# Altium schematic sheet AEGIS_Junction_Box.SchDoc: AEGIS
size 420 x 297 mm; Author: G.Kasprowicz; CompanyName: WUT ISE; DrawnBy: G.Kasprowicz; Organization: WUT ISE; Address1: PW ISE; Address2: Nowowiejska 15/19 00-665 Warsaw; Address3: gkasprow@gmail.com; Revision: 2; SheetNumber: -; SheetTotal: -; ModifiedBy: -; CheckedDate: -; Title2: Junction Box; DivGrp: WUT ISE; Designer: G.Kasprowicz; ModifiedDate: -; ProjectName: Sensor Box
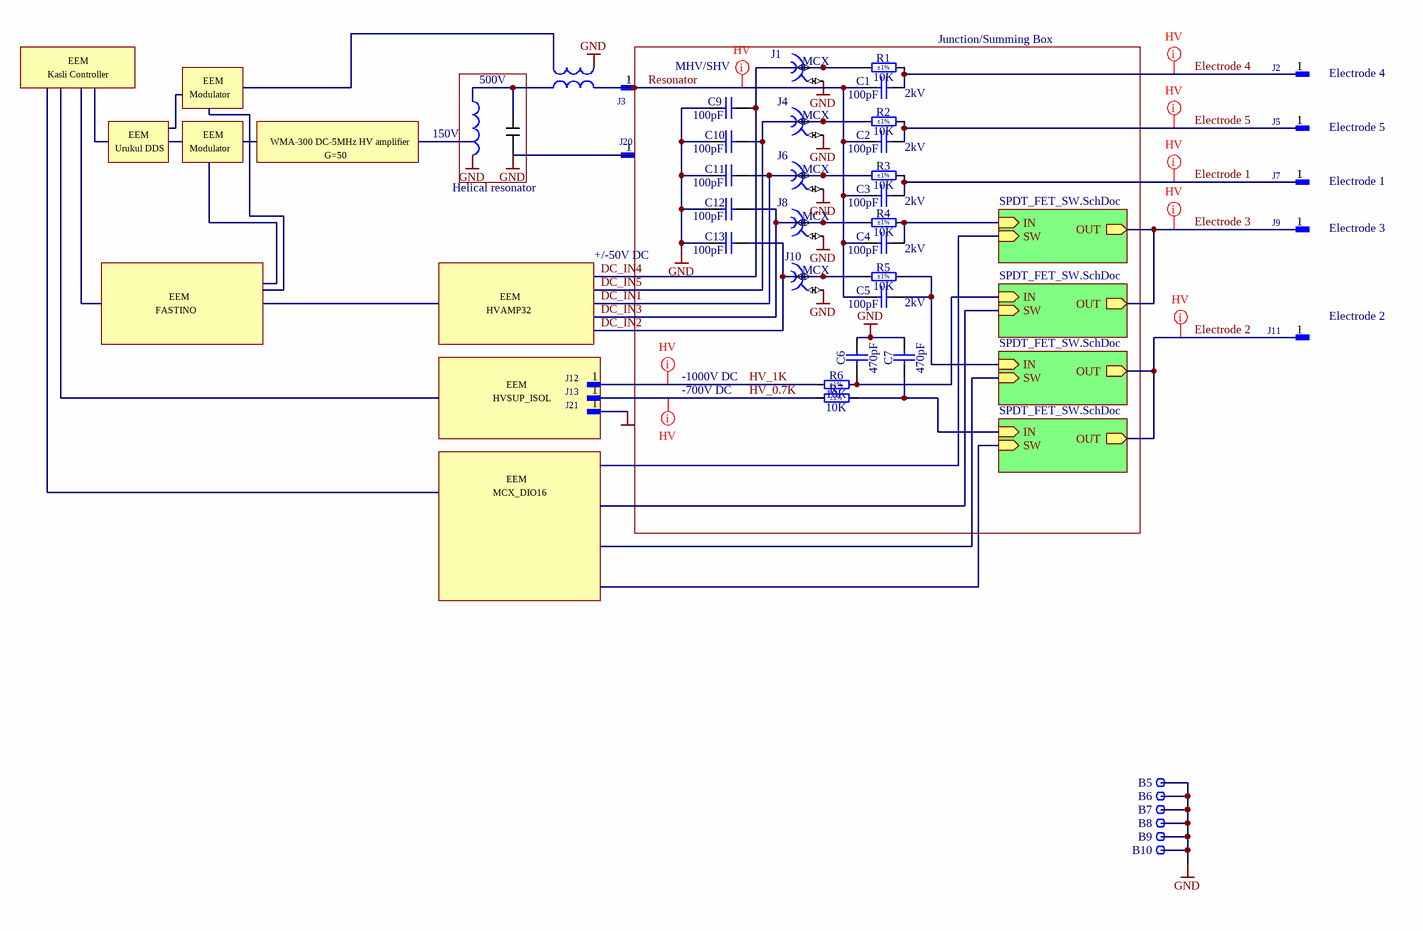
[diagram p0: AEGIS_Junction_Box.SchDoc]

## Parts
B5  Plated Hole  [MTG320_550]  (value not drawn)  (no BOM)
B6  Plated Hole  [MTG320_550]  (value not drawn)  (no BOM)
B7  Plated Hole  [MTG320_550]  (value not drawn)  (no BOM)
B8  Plated Hole  [MTG320_550]  (value not drawn)  (no BOM)
B9  Plated Hole  [MTG320_550]  (value not drawn)  (no BOM)
B10  Plated Hole  [MTG320_550]  (value not drawn)  (no BOM)
C1  100pF  Voltage: 2kV  [CAPC3216X180N]
C2  100pF  Voltage: 2kV  [CAPC3216X180N]
C3  100pF  Voltage: 2kV  [CAPC3216X180N]
C4  100pF  Voltage: 2kV  [CAPC3216X180N]
C5  100pF  Voltage: 2kV  [CAPC3216X180N]
C6  470pF  [CAPC4520X150N]
C7  470pF  [CAPC4520X150N]
C9  100pF  [CAPC2012X135N]
C10  100pF  [CAPC2012X135N]
C11  100pF  [CAPC2012X135N]
C12  100pF  [CAPC2012X135N]
C13  100pF  [CAPC2012X135N]
J1  MCX  [AMPHENOL_919-383J-51A]
J2  SMD Pad  [R400X300]  (value not drawn)
J3  SMD Pad  [R400X300]  (value not drawn)
J4  MCX  [AMPHENOL_919-383J-51A]
J5  SMD Pad  [R400X300]  (value not drawn)
J6  MCX  [AMPHENOL_919-383J-51A]
J7  SMD Pad  [R400X300]  (value not drawn)
J8  MCX  [AMPHENOL_919-383J-51A]
J9  SMD Pad  [R400X300]  (value not drawn)
J10  MCX  [AMPHENOL_919-383J-51A]
J11  SMD Pad  [R400X300]  (value not drawn)
J12  SMD Pad  [R400X300]  (value not drawn)
J13  SMD Pad  [R400X300]  (value not drawn)
J20  SMD Pad  [R400X300]  (value not drawn)
J21  SMD Pad  [R400X300]  (value not drawn)
R1  10K  Tolerance: ±1%  [RESC6532X80N]
R2  10K  Tolerance: ±1%  [RESC6532X80N]
R3  10K  Tolerance: ±1%  [RESC6532X80N]
R4  10K  Tolerance: ±1%  [RESC6532X80N]
R5  10K  Tolerance: ±1%  [RESC6532X80N]
R6  10K  Tolerance: ±1%  [RESC6532X80N]
R7  10K  Tolerance: ±1%  [RESC6532X80N]

## Sub-sheets
SPDT_HV_SW0 = SPDT_FET_SW.SchDoc: IN (in), OUT (out), SW (in)
SPDT_HV_SW1 = SPDT_FET_SW.SchDoc: IN (in), OUT (out), SW (in)
SPDT_HV_SW2 = SPDT_FET_SW.SchDoc: IN (in), OUT (out), SW (in)
SPDT_HV_SW3 = SPDT_FET_SW.SchDoc: IN (in), OUT (out), SW (in)

## Nets
GND: B5.1 B6.1 B7.1 B8.1 B9.1 B10.1 C6.2 C7.2 C9.1 C10.1 C11.1 C12.1 C13.1 J1.2 J4.2 J6.2 J8.2 J10.2 J20.1 J21.1
DC_IN1: C11.2 J6.1 R3.1
DC_IN2: C13.2 J10.1 R5.1
DC_IN3: C12.2 J8.1 R4.1
DC_IN4: C9.2 J1.1 R1.1
DC_IN5: C10.2 J4.1 R2.1
Electrode 1: C3.2 J7.1 R3.2
Electrode 2: J11.1 ; sheet SPDT_HV_SW2/OUT, sheet SPDT_HV_SW3/OUT
Electrode 3: J9.1 ; sheet SPDT_HV_SW0/OUT, sheet SPDT_HV_SW1/OUT
Electrode 4: C1.2 J2.1 R1.2
Electrode 5: C2.2 J5.1 R2.2
HV_0.7K: J13.1 R7.1
HV_1K: J12.1 R6.1
Resonator: C1.1 C2.1 C3.1 C4.1 C5.1 J3.1
NetC4_2: C4.2 R4.2 ; sheet SPDT_HV_SW0/IN
NetC5_2: C5.2 R5.2 ; sheet SPDT_HV_SW2/IN
NetC6_1: C6.1 R6.2 ; sheet SPDT_HV_SW1/IN
NetC7_1: C7.1 R7.2 ; sheet SPDT_HV_SW3/IN

## Layout directives
net class HV: Electrode 1, Electrode 2, Electrode 3, Electrode 4, Electrode 5, HV_0.7K, HV_1K, Resonator

## Notes on the sheet
- Kasli Controller
- EEM
- Modulator
- 500V
- MHV/SHV
- Junction/Summing Box
- (near J2) Electrode 4
- Urukul DDS
- WMA-300 DC-5MHz HV amplifier
- G=50
- 150V
- (near J5) Electrode 5
- Helical resonator
- (near J7) Electrode 1
- (near J9) Electrode 3
- +/-50V DC
- FASTINO
- HVAMP32
- -1000V DC
- (near J11) Electrode 2
- HVSUP_ISOL
- -700V DC
- MCX_DIO16
- Labels drawn without touching a wire or pin: GND
- Project/Equipment
- Document
- Designer
- Drawn by
- Check.by
- Copyright WUT ISE 2020.
  This documentation describes Open Hardware and is licensed under the CERN OHL v.1.2. You may redistribute and modify this documentation under the terms of the CERN OHL v.1.2. (http://ohwr.org/CERNOHL). This documentation is distributed WITHOUT ANY EXPRESS OR IMPLIED WARRANTY, INCLUDING OF MERCHANTABILITY, SATISFACTORY QUALITY AND FITNESS FOR A PARTICULAR PURPOSE. Please see the CERN OHL v.1.2 for applicable conditions.
- Contact
- File
- Last Mod.
- Print Date
- Sheet
- Size
- A3
- of
- Rev

## Library data of the parts
B5-B10 = PLATED_HOLE3.2_PAD5.5: Single Terminal Socket; Part Description: Plated Through Hole: Hole Dia.=3.2mm Pad Dia.=5.5mm; Mounted: No; Part Number: PLATED_HOLE3.2_PAD5.5; Component Type: Standard (No BOM); Pin Count: 1; Family: Plated Hole; Socket: No; SMD: No; Sense: No; Status: None; ComponentHeight: 0mm; HelpURL: Undefined; Author: CERN DEM JMW; CreateDate: 01.10.2012; LatestRevisionDate: 01.10.2012; PackageDescription: Plated Through Hole: Hole Dia.=3.2mm Pad Dia.=5.5mm
C1-C5 = CC1206_100PF_2KV_5%_C0G: Non-polarised capacitor; Part Description: High Voltage MLC Chip Capacitor; Manufacturer: GENERIC; Manufacturer1 Part Number: 1206GA101JAT2A; TC: C0G/NP0; Tolerance: ±5%; Part Number: CC1206_100PF_2KV_5%_C0G; Component Kind: Standard; Component Type: Standard; Pin Count: 2; Value: 100pF; Status: None; Manufacturer Part Number: CC1206_100PF_2KV_5%_C0G; Case: 1206; Mounted: Yes; Socket: No; SMD: Yes; Sense: No; Manufacturer1 Example: AVX; Manufacturer1 ComponentHeight: 1.8mm; HelpURL: \\cern.ch\dfs\Applications\Altium\Datasheets\CC1206_C0G_AVX_HV-MLC.pdf; Author: CERN DEM JLC; CreateDate: 17.05.2017; LatestRevisionDate: 17.05.2017
C6 C7 = CC1808_470PF_2KV_20%_X7R_TDK_CGA7K1X7R3D471M130KA: Non-polarised capacitor; Part Description: High Voltage SMD Multilayer Chip Ceramic Capacitor (Automotive Grade); Manufacturer: TDK; Voltage: 2kV; TC: X7R; Tolerance: ±20%; Part Number: CC1808_470PF_2KV_20%_X7R_TDK_CGA7K1X7R3D471M130KA; Component Kind: Standard; Component Type: Standard; Pin Count: 2; Value: 470pF; Status: Not Recommended; Manufacturer Part Number: CGA7K1X7R3D471M130KA; Case: 1808; Mounted: Yes; Socket: No; SMD: Yes; Sense: No; ComponentHeight: 1.5mm; HelpURL: \\cern.ch\dfs\Applications\Altium\Datasheets\CC1808_X7R_TDK_CGA-HV.pdf; Author: CERN DEM JLC; CreateDate: 30.11.2016; LatestRevisionDate: 30.11.2016
C9-C13 = CC0805_100PF_50V_5%_NP0: Non-polarised capacitor; Part Description: SMD Multilayer Chip Ceramic Capacitor; Manufacturer: GENERIC; Manufacturer1 Part Number: 223886115101; Voltage: 50V; TC: C0G/NP0; Tolerance: ±5%; Part Number: CC0805_100PF_50V_5%_NP0; Component Kind: Standard; Component Type: Standard; Pin Count: 2; Value: 100pF; Status: Preferred; Manufacturer Part Number: CC0805_100PF_50V_5%_NP0; Case: 0805; Mounted: Yes; Socket: No; SMD: Yes; Sense: No; Manufacturer1 Example: PHYCOMP; Manufacturer1 ComponentHeight: 1.35mm; HelpURL: \\cern.ch\dfs\Applications\Altium\Datasheets\CC0805_NP0_PHYCOMP.pdf; Author: CERN DEM JLC; CreateDate: 03.12.2007; LatestRevisionDate: 03.12.2007
J1 J4 J6 J8 J10 = AMPHENOL_919-383J-51A: Part Description: 50 Ohm, RF Connector, MCX Right Angle PCB Receptacle Jack; PressFit: No; Part Number: AMPHENOL_919-383J-51A; Component Kind: Standard; Component Type: Standard; Pin Count: 5; Family: MCX; Mounted: Yes; Socket: No; SMD: No; Sense: No; Status: None; Manufacturer: AMPHENOL; Manufacturer Part Number: 919-383J-51A; ComponentHeight: 6mm; HelpURL: \\cern.ch\dfs\Applications\Altium\Datasheets\AMPHENOL_919-383J-51A.pdf; Author: CERN DEM BC; CreateDate: 31.01.2019; LatestRevisionDate: 31.01.2019
J2 J3 J5 J7 J9 J11-J13 J20 J21 = SMD_PAD_4X3MM: Single SMD Pad; Part Description: 4mm x 3mm SMD Pad; Mounted: No; Part Number: SMD_PAD_4X3MM; Component Kind: Standard (No BOM); Component Type: Standard (No BOM); Pin Count: 1; Family: SMD Pad; Socket: No; SMD: No; Sense: No; Status: None; ComponentHeight: 0mm; HelpURL: Undefined; Author: CERN DEM JLC; CreateDate: 15.03.2010; LatestRevisionDate: 15.03.2010; PackageDescription: 4mm x  3mm SMD Pad
R1-R7 = R2512_10k_1%_1W_100PPM: High Voltage (3kV) Chip Resistor; Manufacturer: TT Electronics; Manufacturer Part Number: HVC2512-10KFT18; Power: 1W; TC: ±100ppm/°C; PressFit: No; Part Number: R2512_10k_1%_1W_100PPM; Component Kind: Standard; Component Type: Standard; Pin Count: 2; Value: 10K; Status: None; Part Description: High Voltage (3kV) Chip Resistor; Case: 2512; Mounted: Yes; Sense: No; Socket: No; SMD: Yes; ComponentHeight: 0.8mm; HelpURL: \\cern.ch\dfs\Applications\Altium\Datasheets\R2512_TT ELECTRONICS_HVC.pdf; Author: GK; CreateDate: 26.11.2014; LatestRevisionDate: 26.11.2014